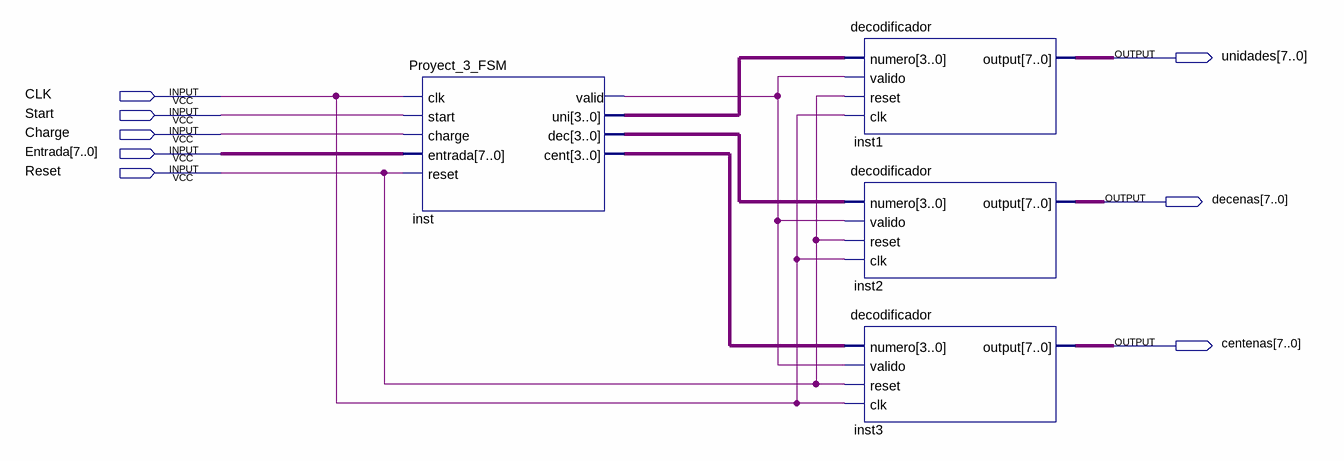
[diagram p0: schematic sheet]
// Quartus schematic Block1.bdf as structural Verilog: 4 symbols, 8 pins
module Block1 (
  input  CLK,
  input  Start,
  input  Charge,
  input  [7:0] Entrada,
  input  Reset,
  output [7:0] unidades,
  output [7:0] decenas,
  output [7:0] centenas
);

  wire inst_valid;
  wire [3:0] inst_cent, inst_dec, inst_uni;

  Proyect_3_FSM inst (
    .clk(CLK), .start(Start), .charge(Charge), .entrada(Entrada), .reset(Reset), .valid(inst_valid),
    .uni(inst_uni), .dec(inst_dec), .cent(inst_cent));
  decodificador inst1 (.numero(inst_uni), .valido(inst_valid), .reset(Reset), .clk(CLK), .\output (unidades));
  decodificador inst2 (.numero(inst_dec), .valido(inst_valid), .reset(Reset), .clk(CLK), .\output (decenas));
  decodificador inst3 (.numero(inst_cent), .valido(inst_valid), .reset(Reset), .clk(CLK), .\output (centenas));
endmodule
